# EasyEDA Pro project ProPrj_STM32音响_2025-06-08.epro, schematic First Test

## Sheets
1 电池保护: Board Name: First Test; Create Date: 2025-04-06; Page Name: 电池保护; Project Name: STM32多功能音响; Schematic Name: Schematic1; Update Date: 2025-04-06; Company: 嘉立创EDA; Page Size: A4; Version: V1.0
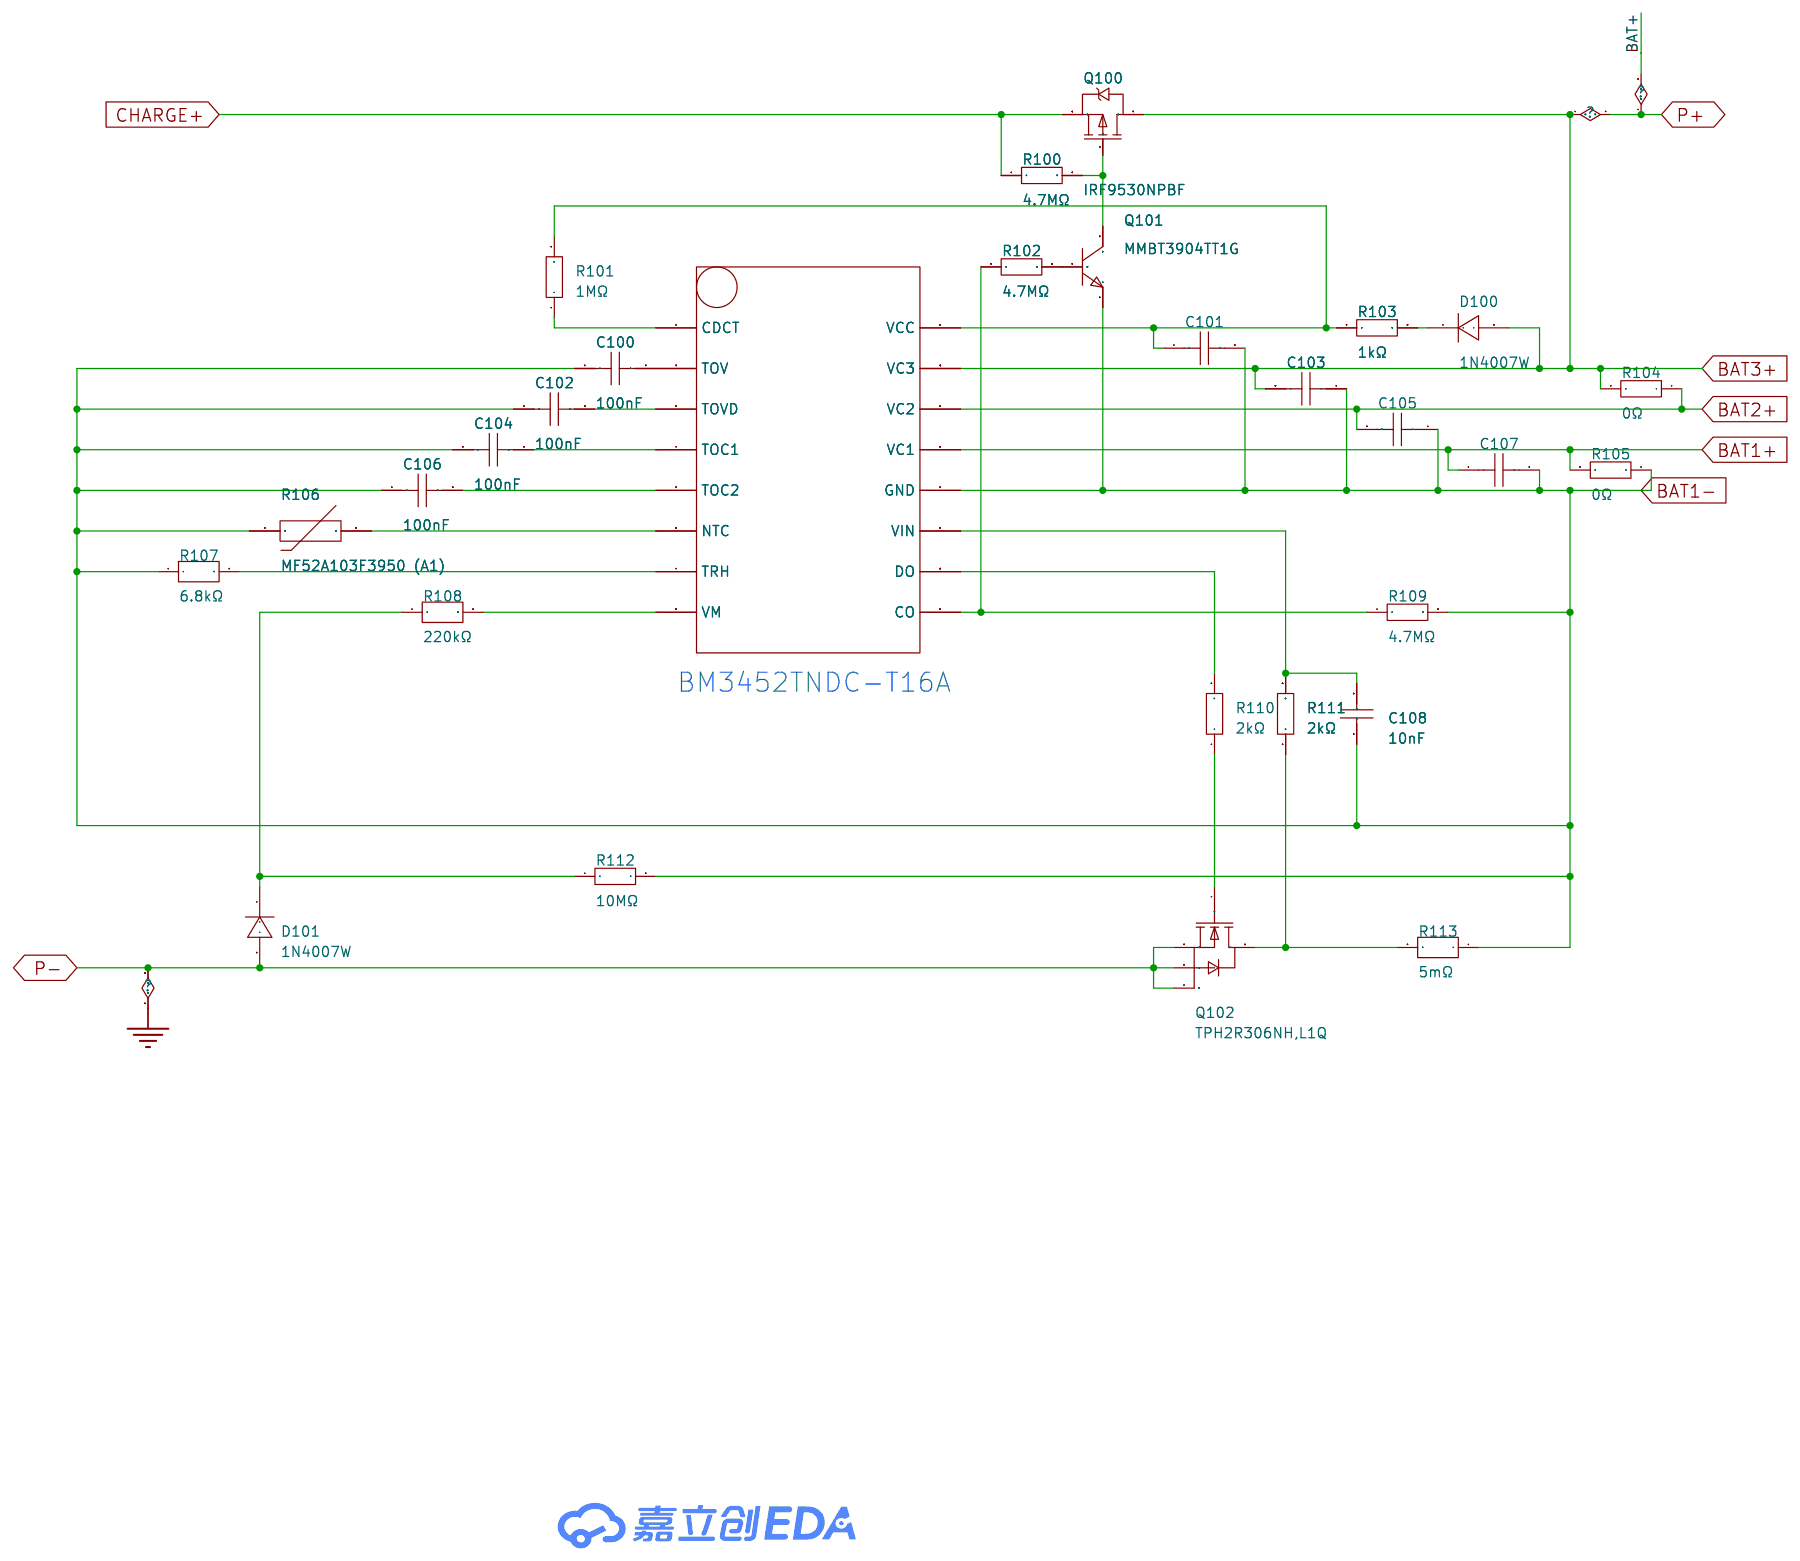
[diagram p0: 电池保护]
2 充电器: Page Name: 充电器
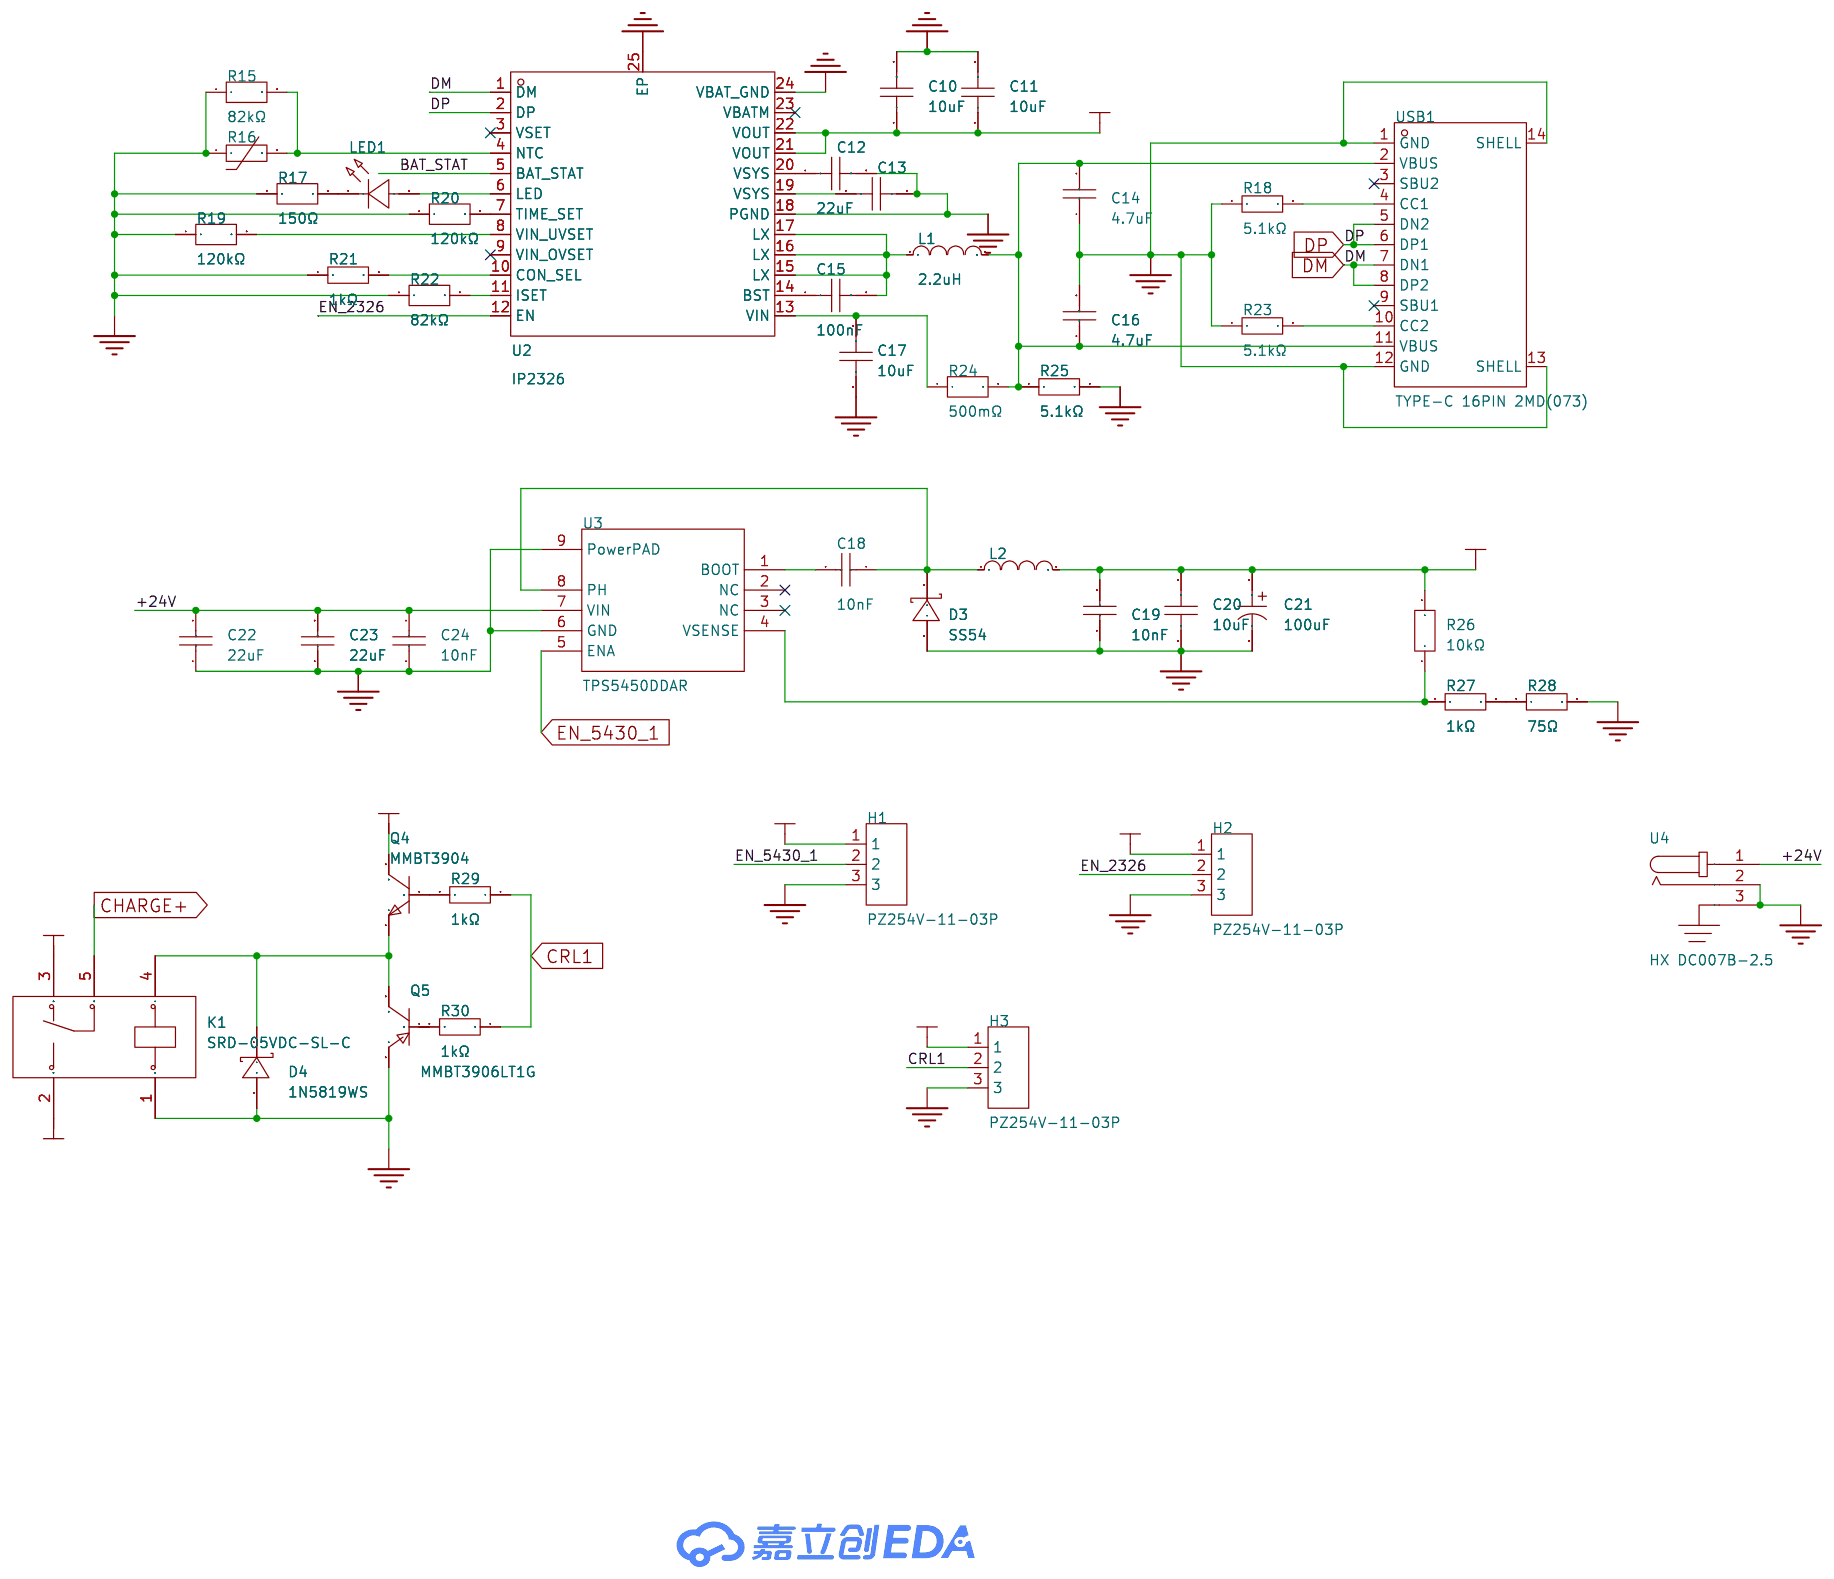
[diagram p1: 充电器]

## Parts
sheet 充电器
C10  10uF  [C1206]
C11  10uF  [C1206]
C12  22uF  [C0805]
C13  22uF  [C0805]
C14  4.7uF  [C1206]
C15  100nF  [C0603]
C16  4.7uF  [C1206]
C17  10uF  [C1206]
C18  10nF  [C0603]
C19  10nF  [C0603]
C20  10uF  [C0805]
C21  100uF  [CAP-TH_BD8.0-P3.50-D0.6-FD]
C22  22uF  [C0805]
C23  22uF  [C0805]
C24  10nF  [C0603]
D3  SS54  [SMA_L4.3-W2.6-LS5.0-RD]
D4  1N5819WS  [SOD-323_L1.8-W1.3-LS2.5-RD]
H1  PZ254V-11-03P  [HDR-TH_3P-P2.54-V-M]
H2  PZ254V-11-03P  [HDR-TH_3P-P2.54-V-M]
H3  PZ254V-11-03P  [HDR-TH_3P-P2.54-V-M]
K1  SRD-05VDC-SL-C  [RELAY-TH_SRD-XXVDC-XL-C]
L1  2.2uH  [IND-SMD_L5.4-W5.2_FXL0530]
L2  68uH  [68uH Inductor]
LED1  XL-1608SURC-06  [LED0603-RD_RED]
Q4  MMBT3904  [SOT-23-3_L2.9-W1.3-P1.90-LS2.4-BR]
Q5  MMBT3906LT1G  [SOT-23-3_L2.9-W1.3-P1.90-LS2.4-BR]
R15  82kΩ  [R0603]
R16  KNTC0603/100KF3950  [R0603]
R17  150Ω  [R0603]
R18  5.1kΩ  [R0603]
R19  120kΩ  [R0603]
R20  120kΩ  [R0603]
R21  1kΩ  [R0603]
R22  82kΩ  [R0603]
R23  5.1kΩ  [R0603]
R24  500mΩ  [RES-SMD_L6.4-W3.2-R2512]
R25  5.1kΩ  [R0603]
R26  10kΩ  [R0603]
R27  1kΩ  [R0603]
R28  75Ω  [R0603]
R29  1kΩ  [R0603]
R30  1kΩ  [R0603]
U2  IP2326  [VQFN-24_L4.0-W4.0-P0.50-BL-EP2.5]
U3  TPS5450DDAR  [ESOP-8_L4.9-W3.9-P1.27-LS6.0-TL-EP]
U4  HX DC007B-2.5  [DC-IN-TH_HX-DC007B-2.5]
USB1  TYPE-C 16PIN 2MD(073)  [USB-C-SMD_TYPE-C-6PIN-2MD-073]
sheet 电池保护
C100  100nF  [C0603]
C101  1uF  [C0603]
C102  100nF  [C0603]
C103  100nF  [C0603]
C104  100nF  [C0603]
C105  100nF  [C0603]
C106  100nF  [C0603]
C107  100nF  [C0603]
C108  10nF  [C0603]
D100  1N4007W  [SOD-123FL_L2.7-W1.8-LS3.8-RD]
D101  1N4007W  [SOD-123FL_L2.7-W1.8-LS3.8-RD]
Q100  IRF9530NPBF  [TO-220-3_L10.0-W4.5-P2.54-L]
Q101  MMBT3904TT1G  [SC-75-3_L1.6-W0.8-P1.00-LS1.6-BR]
Q102  TPH2R306NH,L1Q  [DFN-8_L5.0-W5.0-P1.27-LS6.0-EP]
R100  4.7MΩ  [R0402]
R101  1MΩ  [R0603]
R102  4.7MΩ  [R0402]
R103  1kΩ  [R0603]
R104  0Ω  [R1206]
R105  0Ω  [R1206]
R106  MF52A103F3950 (A1)  [RES-TH_L2.5-W2.5-P1.70-D0.3]
R107  6.8kΩ  [R0603]
R108  220kΩ  [R0603]
R109  4.7MΩ  [R0402]
R110  2kΩ  [R0603]
R111  2kΩ  [R0603]
R112  10MΩ  [R0603]
R113  5mΩ  [RES-SMD_L6.4-W3.2-1]
U100  -  [SOP-16_L10.3-W4.4-P1.27-LS7.0-BL]

## Library data of the parts
C10 C11 C17 = HGC1206R5106K500NSPJ: 容值:10uF;精度:±10%;额定电压:50V;材质(温度系数):X5R;; LCSC Part Name: 10uF ±10% 50V; Supplier Part: C7432781; Manufacturer: Chinocera(华瓷); Supplier Footprint: 1206; JLCPCB Part Class: Extended Part; Datasheet: https://atta.szlcsc.com/upload/public/pdf/source/20240320/FAC3FEC40A78BC5CCCE96C232A94D860.pdf; Supplier: LCSC; Tolerance: ±10%; Voltage Rated: 50V; Temperature Coefficient: X5R
C12 C13 C22 C23 = CGA0805X5R226M350MT: 容值:22uF;精度:±20%;额定电压:35V;材质(温度系数):X5R;; LCSC Part Name: 22uF ±20% 35V; Supplier Part: C6119901; Manufacturer: HRE(芯声); Supplier Footprint: 0805; JLCPCB Part Class: Extended Part; Datasheet: https://atta.szlcsc.com/upload/public/pdf/source/20231129/D589D0CC4D260F7AC3A77E53B455CCB3.pdf; Supplier: LCSC; Tolerance: ±20%; Voltage Rated: 35V; Temperature Coefficient: X5R
C14 C16 = CL31B475KBHNNNE: 容值:4.7uF;精度:±10%;额定电压:50V;材质(温度系数):X7R;; LCSC Part Name: 4.7uF ±10% 50V; Supplier Part: C51205; Manufacturer: SAMSUNG(三星); Supplier Footprint: 1206; JLCPCB Part Class: 扩展库; Datasheet: https://atta.szlcsc.com/upload/public/pdf/source/20160218/1457707763339.pdf; Supplier: LCSC; Tolerance: ±10%; Voltage Rated: 50V; Temperature Coefficient: X7R
C15 C100 C102-C107 = CGA0603X7R104K500JT: 容值:100nF;精度:±10%;额定电压:50V;材质(温度系数):X7R;; LCSC Part Name: 100nF ±10% 50V; Supplier Part: C6119867; Manufacturer: HRE(芯声); Supplier Footprint: 0603; JLCPCB Part Class: Extended Part; Supplier: LCSC; Tolerance: ±10%; Voltage Rated: 50V; Temperature Coefficient: X7R
C18 C19 C24 C108 = CC0603KRX7R9BB103: 容值:10nF;精度:±10%;额定电压:50V;材质(温度系数):X7R;; LCSC Part Name: 10nF ±10% 50V; Supplier Part: C100042; Manufacturer: YAGEO(国巨); Supplier Footprint: 0603; JLCPCB Part Class: 扩展库; Datasheet: https://atta.szlcsc.com/upload/public/pdf/source/20181008/C309510_22F155564471FAF6A489F7D68F34234E.pdf; Supplier: LCSC; Tolerance: ±10%; Voltage Rated: 50V; Temperature Coefficient: X7R
C20 = GRM21BR61H106KE43L: 容值:10uF;精度:±10%;额定电压:50V;材质(温度系数):X5R;; LCSC Part Name: 10uF ±10% 50V; Supplier Part: C440198; Manufacturer: muRata(村田); Supplier Footprint: 0805; JLCPCB Part Class: Basic Part; Datasheet: https://atta.szlcsc.com/upload/public/pdf/source/20230811/95AAE0C9AF55EDC31B7A4D8B733F534E.pdf; Supplier: LCSC; Tolerance: ±10%; Voltage Rated: 50V; Temperature Coefficient: X5R
C21 = KNH4100UF50V149EC0024: 容值:100uF;精度:±20%;额定电压:50V;纹波电流:-;等效串联电阻(ESR):-;类型:-;; LCSC Part Name: 100uF ±20% 50V; Supplier Part: C2927900; Manufacturer: KNSCHA(科尼盛); Supplier Footprint: 插件,D8xL12mm; JLCPCB Part Class: 扩展库; Datasheet: https://atta.szlcsc.com/upload/public/pdf/source/20220426/FBA31D3684889FAFEB49FEEB0664C4A4.pdf; Supplier: LCSC; Tolerance: ±20%; Voltage Rating: 50V; Diameter: 8mm; Height - Seated (Max): 12mm; Operating Temperature: -55℃~+125℃
D3 = SS54_C7420369: 二极管配置:独立式;正向压降(Vf):550mV@5.0A;直流反向耐压(Vr):40V;整流电流:5A;; LCSC Part Name: 电压:40V 电流:5A; Supplier Part: C7420369; Manufacturer: 宏迦橙; Supplier Footprint: SMA(DO-214AC); JLCPCB Part Class: 扩展库; Datasheet: https://atta.szlcsc.com/upload/public/pdf/source/20230828/254C3882F8647358AD9F60DD73611B5E.pdf; Supplier: LCSC; Diode Configuration: 独立式; Forward Voltage (Vf@If): 550mV@5.0A; Reverse Voltage (Vr): 40V; Rectified Current: 5A; Reverse Leakage Current (Ir): 50uA@40V
D4 = 1N5819WS_C191023: 正向压降(Vf):600mV@1A;直流反向耐压(Vr):40V;整流电流:1A;; LCSC Part Name: 电压:40V 电流:1A; Supplier Part: C191023; Manufacturer: Hottech(合科泰); Supplier Footprint: SOD-323; JLCPCB Part Class: 基础库; Datasheet: https://atta.szlcsc.com/upload/public/pdf/source/20220428/3CB86FD8D28D653594B4E35F9D5AEFD9.pdf; Supplier: LCSC; Forward Voltage (Vf@If): 600mV@1A; Reverse Voltage (Vr): 40V; Rectified Current: 1A
H1-H3 = PZ254V-11-03P: 插针结构:1x3P;间距:2.54mm;行距:-;圆针/方针:方针;安装方式:直插;排数:单排;总PIN位数:3P;额定电流:3A;额定电压:250V;配合针长度:6mm;塑高:2.5mm;端接针长度:3mm;工作温度:-40℃~+105℃;颜色:黑色;; LCSC Part Name: 1x3P 间距:2.54mm 方针 直插; Supplier Part: C2937625; Manufacturer: XFCN(兴飞); Supplier Footprint: 插件,P=2.54mm; JLCPCB Part Class: Extended Part; Datasheet: https://atta.szlcsc.com/upload/public/pdf/source/20200309/C492402_8335C3D49C4E4C618838D59BB1D024C1.pdf; Supplier: LCSC; Pin Structure: 1x3P; Pitch: 2.54mm; Circluar Pins/Square Pins: 方针; Mounting Type: 直插; Number of Rows: 单排; Number of Pins: 3P; Current Rating: 3A; Voltage Rating (Max): 250V; Length of Mating Pin: 6mm; Insulation Height: 2.5mm; Length of End Connection Pin: 3mm; Operating Temperature: -40℃~+105℃; Color: 黑色
K1 = SRD-05VDC-SL-C: 线圈电压:5V;触点形式:一组转换:1C(单刀双掷-转换);触点容量(电阻负载):-;最大切换电压:250V@AC;最大切换电流:15A;; LCSC Part Name: 蓝色; Supplier Part: C35449; Manufacturer: 松乐; Supplier Footprint: 插件,15.6x19.2mm; JLCPCB Part Class: Extended Part; Datasheet: https://atta.szlcsc.com/upload/public/pdf/source/20200305/C490149_C96E4098A3B1FFB377D5AD2E40B7C2A8.pdf; Supplier: LCSC; Coil Voltage: 5V; Contact Form: 一组转换:1C(单刀双掷-转换); Pin Number: 5; Maximum Switching Voltage: 250V@AC; Coil Rated Power: 360mW; Maximum Switching Current: 15A; Coil Type: 无极性-单线圈; Coil Resistance: 70Ω; Contact Resistance: 100mΩ; Operate Time: 10ms; Release Time: 10ms
L1 = FXL0530-2R2-M: 电感值:2.2uH;精度:±20%;额定电流:7A;饱和电流(Isat):7.5A;类型:一体成型电感;; LCSC Part Name: 2.2uH ±20% 7.5A; Supplier Part: C177247; Manufacturer: cjiang(长江微电); Supplier Footprint: SMD,5.2x5.4mm; JLCPCB Part Class: Extended Part; Datasheet: https://atta.szlcsc.com/upload/public/pdf/source/20240426/3189EA8206330E2108542F9E34E540E7.pdf; Supplier: LCSC; Tolerance: ±20%; Rated Current: 7A; Saturation Current (Isat): 7.5A; DC Resistance (DCR): 29mΩ; Type: 一体成型电感
L2 = 68uH: Supplier Footprint: L0603
LED1 = XL-1608SURC-06: 发光颜色:红色;功率:55mW;正向电流:25mA;主波长:617nm~621nm;透镜颜色:无色透明透镜;色温:-;发光角度:120°;载带方式:正贴;工作温度:-30℃~+85℃;; Supplier Part: C965799; Manufacturer: XINGLIGHT(成兴光); Supplier Footprint: 0603; JLCPCB Part Class: 扩展库; Datasheet: https://atta.szlcsc.com/upload/public/pdf/source/20221102/D860AFDD1CDB02C5A8064103A32707E2.pdf; Supplier: LCSC; Emitted Color: 红色; Power Dissipation: 55mW; Forward Current: 25mA; Dominant Wavelength: 617nm~621nm; Peak Wavelength: 623nm; Lens Color: 无色透明透镜; Viewing Angle: 120°; Mounting Sytle: 正贴; Operating Temperature: -30℃~+85℃
Q4 = MMBT3904_C7420353: 晶体管类型:NPN;集电极电流(Ic):200mA;集射极击穿电压(Vceo):40V;耗散功率(Pd):200mW;直流电流增益(hFE):100@10mA,1.0V;; LCSC Part Name: hFE:200-300，丝印:1AM MMBT3904; Supplier Part: C7420353; Manufacturer: 宏嘉诚; Supplier Footprint: SOT-23; JLCPCB Part Class: Extended Part; Datasheet: https://atta.szlcsc.com/upload/public/pdf/source/20250107/C89EF9052A149FE4921E3DCD6BE55193.pdf; Supplier: LCSC; type: NPN; Current - Collector(Ic): 200mA; Collector - Emitter Voltage VCEO: 40V; Pd - Power Dissipation: 200mW; DC Current Gain: 100@10mA,1.0V; Transition frequency(fT): 300MHz; Current - Collector Cutoff: 100nA; Vce Saturation(VCE(sat)): 300mV; Operating Temperature: -55℃~+150℃; Transistor Type: NPN; Collector Current (Ic): 200mA; Collector-Emitter Breakdown Voltage (Vceo): 40V; Power Dissipation (Pd): 200mW; DC Current Gain (hFE@Ic,Vce): 100@0.1mA,1.0V; Transition Frequency (fT): 300MHz; Collector Cut-Off Current (Icbo): 50nA; Collector-Emitter Saturation Voltage (VCE(sat)@Ic,Ib): 200mV@10mA,1.0mA
Q5 = MMBT3906LT1G: 晶体管类型:PNP;集电极电流(Ic):200mA;集射极击穿电压(Vceo):40V;功率(Pd):225mW;直流电流增益(hFE@Ic,Vce):60@0.1mA,1.0V;; LCSC Part Name: PNP 电流:200mA 耐压:40V; Supplier Part: C53444; Manufacturer: onsemi(安森美); Supplier Footprint: SOT-23(TO-236); JLCPCB Part Class: 扩展库; Datasheet: https://atta.szlcsc.com/upload/public/pdf/source/20150713/1457707330085.pdf; Supplier: LCSC; Transistor Type: PNP; Collector Current (Ic): 200mA; Collector-Emitter Breakdown Voltage (Vceo): 40V; Power Dissipation (Pd): 225mW; DC Current Gain (hFE@Ic,Vce): 60@0.1mA,1.0V; Transition Frequency (fT): 250MHz; Collector Cut-Off Current (Icbo): 50nA; Collector-Emitter Saturation Voltage (VCE(sat)@Ic,Ib): 250mV@10mA,1.0mA; Operating Temperature: -55℃~+150℃
R15 R22 = FRC0603F8202TS: 电阻类型:厚膜电阻;阻值:82kΩ;精度:±1%;功率:100mW;工作电压:75V;温度系数:±100ppm/℃;; LCSC Part Name: 82kΩ ±1% 100mW 厚膜电阻; Supplier Part: C2907072; Manufacturer: FOJAN(富捷); Supplier Footprint: 0603; JLCPCB Part Class: 扩展库; Datasheet: https://atta.szlcsc.com/upload/public/pdf/source/20211221/925EC7D7225764EE0046F22065062C87.pdf; Supplier: LCSC; Type: 厚膜电阻; Tolerance: ±1%; Power(Watts): 100mW; Voltage-Supply(Max): 75V; Temperature Coefficient: ±100ppm/℃; Operating Temperature: -55℃~+155℃
R16 = KNTC0603/100KF3950: 阻值:100kΩ;B值(25℃/50℃):3950K;功率:100mW;B值精度:±1%;最大稳态电流(25℃):100uA;; Supplier Part: C2892545; Manufacturer: KUU; Supplier Footprint: 0603; JLCPCB Part Class: Extended Part; Datasheet: https://atta.szlcsc.com/upload/public/pdf/source/20210908/FAA8C255963A129B4BD305DA7EAE142A.pdf; Supplier: LCSC; Resistance @ 25℃: 100kΩ; B Constant (25℃/50℃): 3950K; B Constant (25℃/85℃): 4010K; Power(Watts): 100mW; B Constant Tolerance: ±1%; Steady State Current (Max): 100uA; Operating Temperature: -40℃~+125℃
R17 = FRC0603J151 TS: 电阻类型:厚膜电阻;阻值:150Ω;精度:±5%;功率:100mW;工作电压:75V;温度系数:±100ppm/℃;; LCSC Part Name: 150Ω ±5% 100mW 厚膜电阻; Supplier Part: C2907103; Manufacturer: FOJAN(富捷); Supplier Footprint: 0603; JLCPCB Part Class: Extended Part; Datasheet: https://atta.szlcsc.com/upload/public/pdf/source/20211221/925EC7D7225764EE0046F22065062C87.pdf; Supplier: LCSC; Type: 厚膜电阻; Tolerance: ±5%; Power(Watts): 100mW; Voltage-Supply(Max): 75V; Temperature Coefficient: ±100ppm/℃; Operating Temperature: -55℃~+155℃
R18 R23 R25 = 0603WAF5101T5E: 电阻类型:厚膜电阻;阻值:5.1kΩ;精度:±1%;功率:100mW;最大工作电压:75V;温度系数:±100ppm/℃;; LCSC Part Name: 5.1kΩ ±1% 100mW 厚膜电阻; Supplier Part: C23186; Manufacturer: UNI-ROYAL(厚声); Supplier Footprint: 0603; JLCPCB Part Class: 基础库; Datasheet: https://atta.szlcsc.com/upload/public/pdf/source/20200306/C422600_1E6D84923E4A46A82E41ADD87F860B5C.pdf; Supplier: LCSC; Type: 厚膜电阻; Tolerance: ±1%; Power(Watts): 100mW; Overload Voltage (Max): 75V; Temperature Coefficient: ±100ppm/℃; Operating Temperature Range: -55℃~+155℃
R19 R20 = FRC0603F1203TS: 电阻类型:厚膜电阻;阻值:120kΩ;精度:±1%;功率:100mW;最大工作电压:75V;温度系数:±100ppm/℃;; LCSC Part Name: 120kΩ ±1% 100mW 厚膜电阻; Supplier Part: C2906987; Manufacturer: FOJAN(富捷); Supplier Footprint: 0603; JLCPCB Part Class: 扩展库; Datasheet: https://atta.szlcsc.com/upload/public/pdf/source/20211221/925EC7D7225764EE0046F22065062C87.pdf; Supplier: LCSC; Type: 厚膜电阻; Tolerance: ±1%; Power(Watts): 100mW; Overload Voltage (Max): 75V; Temperature Coefficient: ±100ppm/℃; Operating Temperature Range: -55℃~+155℃
R21 R27 R29 R30 R103 = 0603WAF1001T5E: 电阻类型:厚膜电阻;阻值:1kΩ;精度:±1%;功率:100mW;最大工作电压:75V;温度系数:±100ppm/℃;; LCSC Part Name: 1kΩ ±1% 100mW 厚膜电阻; Supplier Part: C21190; Manufacturer: UNI-ROYAL(厚声); Supplier Footprint: 0603; JLCPCB Part Class: Basic Part; Datasheet: https://atta.szlcsc.com/upload/public/pdf/source/20200306/C422600_1E6D84923E4A46A82E41ADD87F860B5C.pdf; Supplier: LCSC; Type: 厚膜电阻; Tolerance: ±1%; Power(Watts): 100mW; Overload Voltage (Max): 75V; Temperature Coefficient: ±100ppm/℃; Operating Temperature Range: -55℃~+155℃
R24 = HoJLR2512-3W-500mR-1%: 电阻类型:采样电阻;阻值:500mΩ;精度:±1%;功率:3W;安装方式:贴片;; LCSC Part Name: 500mΩ ±1% 3W; Supplier Part: C2904268; Manufacturer: Milliohm(毫欧); Supplier Footprint: 2512; JLCPCB Part Class: 扩展库; Datasheet: https://atta.szlcsc.com/upload/public/pdf/source/20211009/7525CABAB363C979E942C1DD41F1FEF0.pdf; Supplier: LCSC; Type: 采样电阻; Tolerance: ±1%; Power(Watts): 3W; Mounting Sytle: 贴片
R26 = FRC0603J103TS: 电阻类型:厚膜电阻;阻值:10kΩ;精度:±5%;功率:100mW;最大工作电压:75V;温度系数:±100ppm/℃;; LCSC Part Name: 10kΩ ±5% 100mW 厚膜电阻; Supplier Part: C2930027; Manufacturer: FOJAN(富捷); Supplier Footprint: 0603; JLCPCB Part Class: Extended Part; Datasheet: https://atta.szlcsc.com/upload/public/pdf/source/20211221/925EC7D7225764EE0046F22065062C87.pdf; Supplier: LCSC; Type: 厚膜电阻; Tolerance: ±5%; Power(Watts): 100mW; Overload Voltage (Max): 75V; Temperature Coefficient: ±100ppm/℃; Operating Temperature Range: -55℃~+155℃
R28 = 0603WAF750JT5E: 电阻类型:厚膜电阻;阻值:75Ω;精度:±1%;功率:100mW;最大工作电压:75V;温度系数:±200ppm/℃;; LCSC Part Name: 75Ω ±1% 100mW 厚膜电阻; Supplier Part: C4275; Manufacturer: UNI-ROYAL(厚声); Supplier Footprint: 0603; JLCPCB Part Class: 基础库; Datasheet: https://atta.szlcsc.com/upload/public/pdf/source/20200306/C422600_1E6D84923E4A46A82E41ADD87F860B5C.pdf; Supplier: LCSC; Type: 厚膜电阻; Tolerance: ±1%; Power(Watts): 100mW; Overload Voltage (Max): 75V; Temperature Coefficient: ±200ppm/℃; Operating Temperature Range: -55℃~+155℃
U2 = IP2326: Supplier Part: C2832094; Manufacturer: INJOINIC(英集芯); Supplier Footprint: VQFN-24-EP(4x4); JLCPCB Part Class: 扩展库; Datasheet: https://atta.szlcsc.com/upload/public/pdf/source/20210701/C2832094_E17C44C11E64EBC07E8B83E7E48DDEF6.pdf; Supplier: LCSC
U3 = TPS5450DDAR: 功能类型:降压型;输出类型:可调;输入电压:5.5V~36V;输出电压:1.221V~31.32V;输出电流(最大值):5A;; Supplier Part: C114425; Manufacturer: TI(德州仪器); Supplier Footprint: SOP-8-EP-150mil; JLCPCB Part Class: Extended Part; Datasheet: https://www.ti.com/cn/lit/gpn/tps5450; Supplier: LCSC; Function: 降压型; Output Type: 可调; Input Voltage: 5.5V~36V; Output Voltage: 1.221V~31.32V; Output Current (Max): 5A; Switching Frequency: 500kHz; Operating Temperature: -40℃~+125℃@(TJ); Synchronous Rectification: 否; Number of Outputs: 1; Topology: 降压式; Switch tube (built-in/external): 内置
U4 = HX DC007B-2.5: 连接器类型:DC电源插座;安装方式:弯插;触点内径:2.5mm;触点外径:6.4mm;额定电流:7A;额定电压:20V;工作温度范围:-25℃~+70℃;; LCSC Part Name: DC电源插座 内径:2.5mm 外径:6.4mm; Supplier Part: C19189083; Manufacturer: hanxia(韩下); Supplier Footprint: 插件; JLCPCB Part Class: 扩展库; Datasheet: https://atta.szlcsc.com/upload/public/pdf/source/20231103/814B3421283469BAAEFFF9B7A53EC0CB.pdf; Supplier: LCSC; Connector Type: DC电源插座; Mounting Style: 弯插; Inside Contact Diameter: 2.5mm; Outside Contact Diameter: 6.4mm; Current Rating (Max): 7A; Voltage Rating (Max): 20V; Operating Temperature Range: -25℃~+70℃
USB1 = TYPE-C 16PIN 2MD(073): 连接器类型:Type-C;标准:USB 3.1;公母:母;安装方式:卧贴;触点数量:16P;端口数量:1;额定电流 - 电源:5A;工作温度范围:-25℃~+85℃;; LCSC Part Name: Type-C 母 卧贴; Supplier Part: C2765186; Manufacturer: SHOU HAN(首韩); Supplier Footprint: SMD; JLCPCB Part Class: 扩展库; Datasheet: https://atta.szlcsc.com/upload/public/pdf/source/20211123/39B17C16241EAC15C5E277BDA434118E.pdf; Supplier: LCSC; Connector Type: Type-C; Standard: USB 3.1; Gender: 母; Mounting Style: 卧贴; Number of Contacts: 16P; Number of Ports: 1; Current Rating - Power (Max): 5A; Operating Temperature Range: -25℃~+85℃; Rated Voltage (Max): 5V; Connect-Disconnect Life: 5千次; Core Colour: 黑色
C101 = CL10A105KB8NNNC: 容值:1uF;精度:±10%;额定电压:50V;材质(温度系数):X5R;; LCSC Part Name: 1uF ±10% 50V; Supplier Part: C15849; Manufacturer: SAMSUNG(三星); Supplier Footprint: 0603; JLCPCB Part Class: Basic Part; Datasheet: https://atta.szlcsc.com/upload/public/pdf/source/20160218/1457707763339.pdf; Supplier: LCSC; Tolerance: ±10%; Voltage Rated: 50V; Temperature Coefficient: X5R
D100 D101 = 1N4007W_C18199088: 二极管配置:独立式;正向压降(Vf):1V@1.0A;直流反向耐压(Vr):1kV;整流电流:1A;; Supplier Part: C18199088; Manufacturer: 宏迦橙; Supplier Footprint: SOD-123FL; JLCPCB Part Class: 扩展库; Datasheet: https://atta.szlcsc.com/upload/public/pdf/source/20230925/B0AB2B510D392D7083D021E804ED238F.pdf; Supplier: LCSC; Diode Configuration: 独立式; Forward Voltage (Vf@If): 1V@1.0A; Reverse Voltage (Vr): 1kV; Rectified Current: 1A; Reverse Leakage Current (Ir): 2uA@1000V
Q100 = IRF9530NPBF: 类型:1个P沟道;漏源电压(Vdss):100V;连续漏极电流(Id):14A;导通电阻(RDS(on)@Vgs,Id):200mΩ@10V,8.4A;功率(Pd):79W;阈值电压(Vgs(th)@Id):2V;; LCSC Part Name: 1个P沟道 耐压:100V 电流:14A; Supplier Part: C2574; Manufacturer: Infineon(英飞凌); Supplier Footprint: TO-220AB; JLCPCB Part Class: Extended Part; Datasheet: https://atta.szlcsc.com/upload/public/pdf/source/20200421/C513189_8847F355D0C4CB22F8DFF828DD9A7461.pdf; Supplier: LCSC; Type: 1个P沟道; Drain Source Voltage (Vdss): 100V; Continuous Drain Current (Id): 14A; Drain Source On Resistance (RDS(on)@Vgs,Id): 200mΩ@10V,8.4A; Power Dissipation (Pd): 79W; Gate Threshold Voltage (Vgs(th)@Id): 2V; Total Gate Charge (Qg@Vgs): 58nC; Input Capacitance (Ciss@Vds): 760pF; Reverse Transfer Capacitance (Crss@Vds): 170pF; Operating Temperature: -55℃~+175℃
Q101 = MMBT3904TT1G: 晶体管类型:NPN;集电极电流(Ic):200mA;集射极击穿电压(Vceo):40V;功率(Pd):200mW;直流电流增益(hFE@Ic,Vce):100@0.1mA,1.0V;; LCSC Part Name: NPN 电流:200mA 耐压:40V; Supplier Part: C242260; Manufacturer: onsemi(安森美); Supplier Footprint: SOT-416; JLCPCB Part Class: 扩展库; Datasheet: https://atta.szlcsc.com/upload/public/pdf/source/20221020/8C70A8ED36C1D333CEA0E7EE045B4434.pdf; Supplier: LCSC; Transistor Type: NPN; Collector Current (Ic): 200mA; Collector-Emitter Breakdown Voltage (Vceo): 40V; Power Dissipation (Pd): 200mW; DC Current Gain (hFE@Ic,Vce): 100@0.1mA,1.0V; Transition Frequency (fT): 300MHz; Collector Cut-Off Current (Icbo): 50nA; Collector-Emitter Saturation Voltage (VCE(sat)@Ic,Ib): 200mV@10mA,1.0mA; Operating Temperature: -65℃~+150℃
Q102 = TPH2R306NH,L1Q: 类型:1个N沟道;漏源电压(Vdss):60V;连续漏极电流(Id):130A;导通电阻(RDS(on)@Vgs,Id):1.9mΩ@10V,30A;功率(Pd):78W;阈值电压(Vgs(th)@Id):4V@1.0mA;; LCSC Part Name: 1个N沟道 耐压:60V 电流:130A; Supplier Part: C146343; Manufacturer: TOSHIBA(东芝); Supplier Footprint: VDFN-8(5x5); JLCPCB Part Class: 扩展库; Datasheet: https://atta.szlcsc.com/upload/public/pdf/source/20230529/77DDCF78FE52467FC52662B5372759F6.pdf; Supplier: LCSC; Type: 1个N沟道; Drain Source Voltage (Vdss): 60V; Continuous Drain Current (Id): 130A; Drain Source On Resistance (RDS(on)@Vgs,Id): 1.9mΩ@10V,30A; Power Dissipation (Pd): 78W; Gate Threshold Voltage (Vgs(th)@Id): 4V@1.0mA; Total Gate Charge (Qg@Vgs): 72nC@10V; Input Capacitance (Ciss@Vds): 6.1nF@30V; Reverse Transfer Capacitance (Crss@Vds): 100pF@30V; Operating Temperature: -55℃~+150℃
R100 R102 R109 = 0402WGF4704TCE: 电阻类型:厚膜电阻;阻值:4.7MΩ;精度:±1%;功率:62.5mW;最大工作电压:50V;温度系数:±100ppm/℃;; LCSC Part Name: 4.7MΩ ±1% 62.5mW 厚膜电阻; Supplier Part: C474132; Manufacturer: UNI-ROYAL(厚声); Supplier Footprint: 0402; JLCPCB Part Class: Extended Part; Datasheet: https://atta.szlcsc.com/upload/public/pdf/source/20200306/C422600_1E6D84923E4A46A82E41ADD87F860B5C.pdf; Supplier: LCSC; Type: 厚膜电阻; Tolerance: ±1%; Power(Watts): 62.5mW; Overload Voltage (Max): 50V; Temperature Coefficient: ±100ppm/℃; Operating Temperature Range: -55℃~+155℃
R101 = 0603WAF1004T5E: 电阻类型:厚膜电阻;阻值:1MΩ;精度:±1%;功率:100mW;最大工作电压:75V;温度系数:±100ppm/℃;; LCSC Part Name: 1MΩ ±1% 100mW 厚膜电阻; Supplier Part: C22935; Manufacturer: UNI-ROYAL(厚声); Supplier Footprint: 0603; JLCPCB Part Class: 基础库; Datasheet: https://atta.szlcsc.com/upload/public/pdf/source/20200306/C422600_1E6D84923E4A46A82E41ADD87F860B5C.pdf; Supplier: LCSC; Type: 厚膜电阻; Tolerance: ±1%; Power(Watts): 100mW; Overload Voltage (Max): 75V; Temperature Coefficient: ±100ppm/℃; Operating Temperature Range: -55℃~+155℃
R104 R105 = 1206W4F0000T5E: 电阻类型:厚膜电阻;阻值:0Ω;精度:±1%;功率:250mW;最大工作电压:200V;温度系数:±800ppm/℃;; LCSC Part Name: 0Ω ±1% 250mW 厚膜电阻; Supplier Part: C17888; Manufacturer: UNI-ROYAL(厚声); Supplier Footprint: 1206; JLCPCB Part Class: 基础库; Datasheet: https://atta.szlcsc.com/upload/public/pdf/source/20200306/C422600_1E6D84923E4A46A82E41ADD87F860B5C.pdf; Supplier: LCSC; Type: 厚膜电阻; Tolerance: ±1%; Power(Watts): 250mW; Overload Voltage (Max): 200V; Temperature Coefficient: ±800ppm/℃; Operating Temperature Range: -55℃~+155℃
R106 = MF52A103F3950 (A1): 阻值(25℃):10kΩ;B值(25℃/50℃):3950K;电阻精度:±1%;功率:50mW;B值精度:±1%;最大稳态电流(25℃):-;; LCSC Part Name: 10kΩ 电阻精度:±1% 3950K; Supplier Part: C13879; Manufacturer: 时恒; Supplier Footprint: 插件,P=1.7mm; JLCPCB Part Class: 扩展库; Datasheet: https://atta.szlcsc.com/upload/public/pdf/source/20181018/C324070_6015F64EA824A635FDB9BBFA1E1FD5FE.pdf; Supplier: LCSC; Resistance @ 25℃: 10kΩ; B Constant (25℃/50℃): 3950K; Resistance Tolerance: ±1%; Power: 50mW; B Constant Tolerance: ±1%; Operating Temperature: -55℃~+125℃
R107 = FRC0603F6801TS: 电阻类型:厚膜电阻;阻值:6.8kΩ;精度:±1%;功率:100mW;最大工作电压:75V;温度系数:±100ppm/℃;; LCSC Part Name: 6.8kΩ ±1% 100mW 厚膜电阻; Supplier Part: C2907055; Manufacturer: FOJAN(富捷); Supplier Footprint: 0603; JLCPCB Part Class: 扩展库; Datasheet: https://atta.szlcsc.com/upload/public/pdf/source/20211221/925EC7D7225764EE0046F22065062C87.pdf; Supplier: LCSC; Type: 厚膜电阻; Tolerance: ±1%; Power(Watts): 100mW; Overload Voltage (Max): 75V; Temperature Coefficient: ±100ppm/℃; Operating Temperature Range: -55℃~+155℃
R108 = FRC0603F2203TS: 电阻类型:厚膜电阻;阻值:220kΩ;精度:±1%;功率:100mW;工作电压:75V;温度系数:±100ppm/℃;; LCSC Part Name: 220kΩ ±1% 100mW 厚膜电阻; Supplier Part: C2907013; Manufacturer: FOJAN(富捷); Supplier Footprint: 0603; JLCPCB Part Class: 扩展库; Datasheet: https://atta.szlcsc.com/upload/public/pdf/source/20211221/925EC7D7225764EE0046F22065062C87.pdf; Supplier: LCSC; Type: 厚膜电阻; Tolerance: ±1%; Power(Watts): 100mW; Voltage-Supply(Max): 75V; Temperature Coefficient: ±100ppm/℃; Operating Temperature: -55℃~+155℃
R110 R111 = 0603WAF2001T5E: 电阻类型:厚膜电阻;阻值:2kΩ;精度:±1%;功率:100mW;最大工作电压:75V;温度系数:±100ppm/℃;; LCSC Part Name: 2kΩ ±1% 100mW 厚膜电阻; Supplier Part: C22975; Manufacturer: UNI-ROYAL(厚声); Supplier Footprint: 0603; JLCPCB Part Class: 基础库; Datasheet: https://atta.szlcsc.com/upload/public/pdf/source/20200306/C422600_1E6D84923E4A46A82E41ADD87F860B5C.pdf; Supplier: LCSC; Type: 厚膜电阻; Tolerance: ±1%; Power(Watts): 100mW; Overload Voltage (Max): 75V; Temperature Coefficient: ±100ppm/℃; Operating Temperature Range: -55℃~+155℃
R112 = RC0603FR-0710ML: 电阻类型:厚膜电阻;阻值:10MΩ;精度:±1%;功率:100mW;最大工作电压:75V;温度系数:±100ppm/℃;; LCSC Part Name: 厚膜电阻 10MΩ ±1% 100mW; Supplier Part: C114606; Manufacturer: YAGEO(国巨); Supplier Footprint: 0603; JLCPCB Part Class: 扩展库; Datasheet: https://atta.szlcsc.com/upload/public/pdf/source/20180821/C275644_0D56F95EFF785E7D9A1FEF436B37DA78.pdf; Supplier: LCSC; Type: 厚膜电阻; Tolerance: ±1%; Power(Watts): 100mW; Overload Voltage (Max): 75V; Temperature Coefficient: ±100ppm/℃; Operating Temperature Range: -55℃~+155℃
R113 = HoJLR2512-3W-5mR-1%: 电阻类型:采样电阻;阻值:5mΩ;精度:±1%;功率:3W;安装方式:贴片;; LCSC Part Name: 5mΩ ±1% 3W; Supplier Part: C2903482; Manufacturer: Milliohm(毫欧); Supplier Footprint: 2512; JLCPCB Part Class: 扩展库; Datasheet: https://atta.szlcsc.com/upload/public/pdf/source/20211009/7525CABAB363C979E942C1DD41F1FEF0.pdf; Supplier: LCSC; Type: 采样电阻; Tolerance: ±1%; Power(Watts): 3W; Mounting Sytle: 贴片
U100 = BM3452: 比亚迪的电池管理芯片

## Nets
+5V_A: H1.1 H2.1 H3.1 Q4.3(C)
+12.6V_1: C19.1 C20.2 C21.1 K1.2 L2.2 R26.2
+12.6V_2: C10.1 C11.1 K1.3 U2.21(VOUT) U2.22(VOUT)
+24V: C22.2 C23.2 C24.2 U3.7(VIN) U4.1
GND: C10.2 C11.2 C12.2 C13.2 C14.1 C16.2 C17.2 C19.2 C20.1 C21.2 C22.1 C23.1 C24.1 D3.2(A) D4.2(A) D101.2(A) H1.3 H2.3 H3.3 K1.1 Q5.2(E) Q102.1(S) Q102.2(S) Q102.3(S) R15.1 R16.1 R17.1 R18.1 R19.1 R20.1 R21.1 R22.1 R23.1 R25.2 R28.2 U2.18(PGND) U2.24(VBAT_GND) U2.25(EP) U3.6(GND) U3.9(PowerPAD) U4.2 U4.3 USB1.1(GND) USB1.12(GND) USB1.13(SHELL) USB1.14(SHELL)
BAT1+: C107.1 R105.2 U100.13(VC1)
BAT1-: C100.1 C101.2 C102.1 C103.1 C104.1 C105.1 C106.1 C107.2 C108.1 Q101.2(E) R105.1 R106.1 R107.1 R109.2 R112.2 R113.1 U100.12(GND)
BAT2+: C105.2 R104.1 U100.14(VC2)
BAT+: C103.2 D100.2(A) Q100.2(D) R104.2 U100.15(VC3)
BAT_STAT: U2.5(BAT_STAT)
CHARGE+: K1.5 Q100.3(S) R100.1
CRL1: H3.2 R29.1 R30.1
DM: U2.1(DM) USB1.7(DN1) USB1.8(DP2)
DP: U2.2(DP) USB1.5(DN2) USB1.6(DP1)
EN_2326: H2.2 U2.12(EN)
EN_5430_1: H1.2 U3.5(ENA)
$1N1192: C101.1 R101.2 R103.1 U100.16(VCC)
$1N1194: Q100.1(G) Q101.3(C) R100.2
$1N1201: C108.2 R111.2 U100.11(VIN)
$1N1202: R110.2 U100.10(DO)
$1N1203: Q102.4(G) R110.1
$1N1205: D100.1(K) R103.2
$1N1206: R102.1 R109.1 U100.9(CO)
$1N1208: Q101.1(B) R102.2
$1N1209: D101.1(K) R108.1 R112.1
$1N1210: C104.2 U100.4(TOC1)
$1N1211: C100.2 U100.2(TOV)
$1N1212: R101.1 U100.1(CDCT)
$1N1213: C102.2 U100.3(TOVD)
$1N1214: R106.2 U100.6(NTC)
$1N1215: C106.2 U100.5(TOC2)
$1N1216: R108.2 U100.8(VM)
$1N1217: R107.2 U100.7(TRH)
$2N1143: C15.2 L1.1 U2.15(LX) U2.16(LX) U2.17(LX)
$2N1144: C14.2 C16.1 L1.2 R24.2 R25.1 USB1.2(VBUS) USB1.11(VBUS)
$2N1146: C15.1 U2.14(BST)
$2N1148: C17.1 R24.1 U2.13(VIN)
$2N1151: R18.2 USB1.4(CC1)
$2N1152: R23.2 USB1.10(CC2)
$2N1157: C12.1 U2.20(VSYS)
$2N1158: C13.1 U2.19(VSYS)
$2N1168: R15.2 R16.2 U2.4(NTC)
$2N1171: R20.2 U2.7(TIME_SET)
$2N1172: LED1.2(A) U2.6(LED)
$2N1173: LED1.1(K) R17.2
$2N1174: R22.2 U2.11(ISET)
$2N1179: R21.2 U2.10(CON_SEL)
$2N1180: R19.2 U2.8(VIN_UVSET)
$2N1727: C18.2 U3.1(BOOT)
$2N1728: C18.1 D3.1(K) L2.1 U3.8(PH)
$2N1732: R26.1 R27.1 U3.4(VSENSE)
$2N1736: R27.2 R28.1
$2N2052: Q4.1(B) R29.2
$2N2053: Q5.1(B) R30.2
$2N2055: D4.1(K) K1.4 Q4.2(E) Q5.3(C)
Net-(Q102-5): Q102.5(D) R111.1 R113.2

Not connected (* = marked no-connect by the designer): U2 3(VSET)* 9(VIN_OVSET)* 23(VBATM)*; U3 2(NC)* 3(NC)*; USB1 3(SBU2)* 9(SBU1)*
